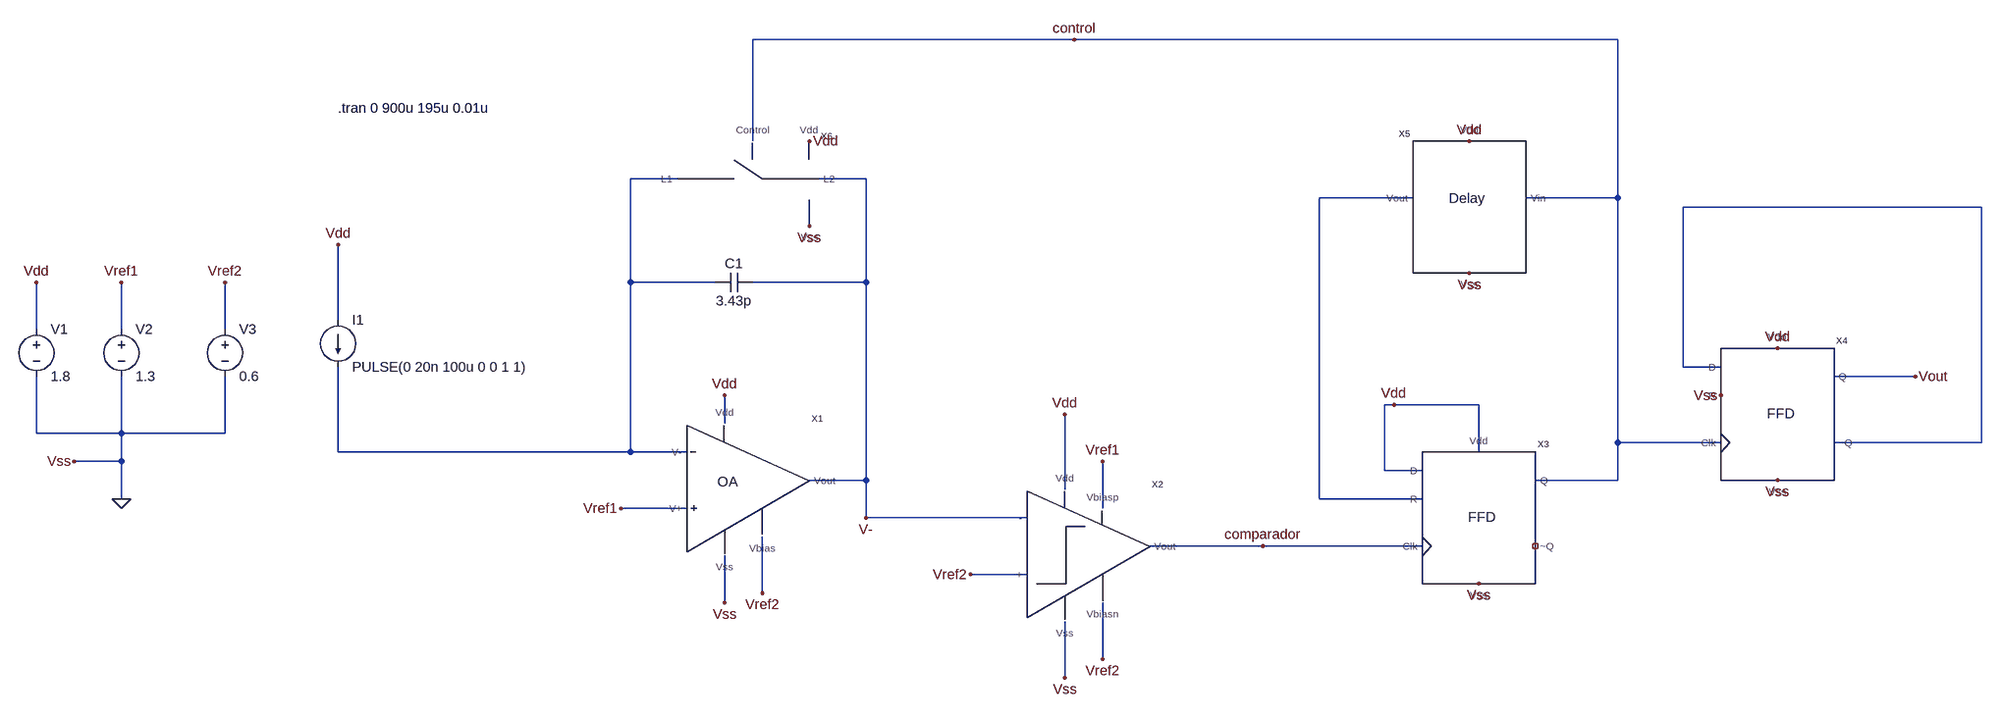
[diagram p0: schematic TOTAL.asc]
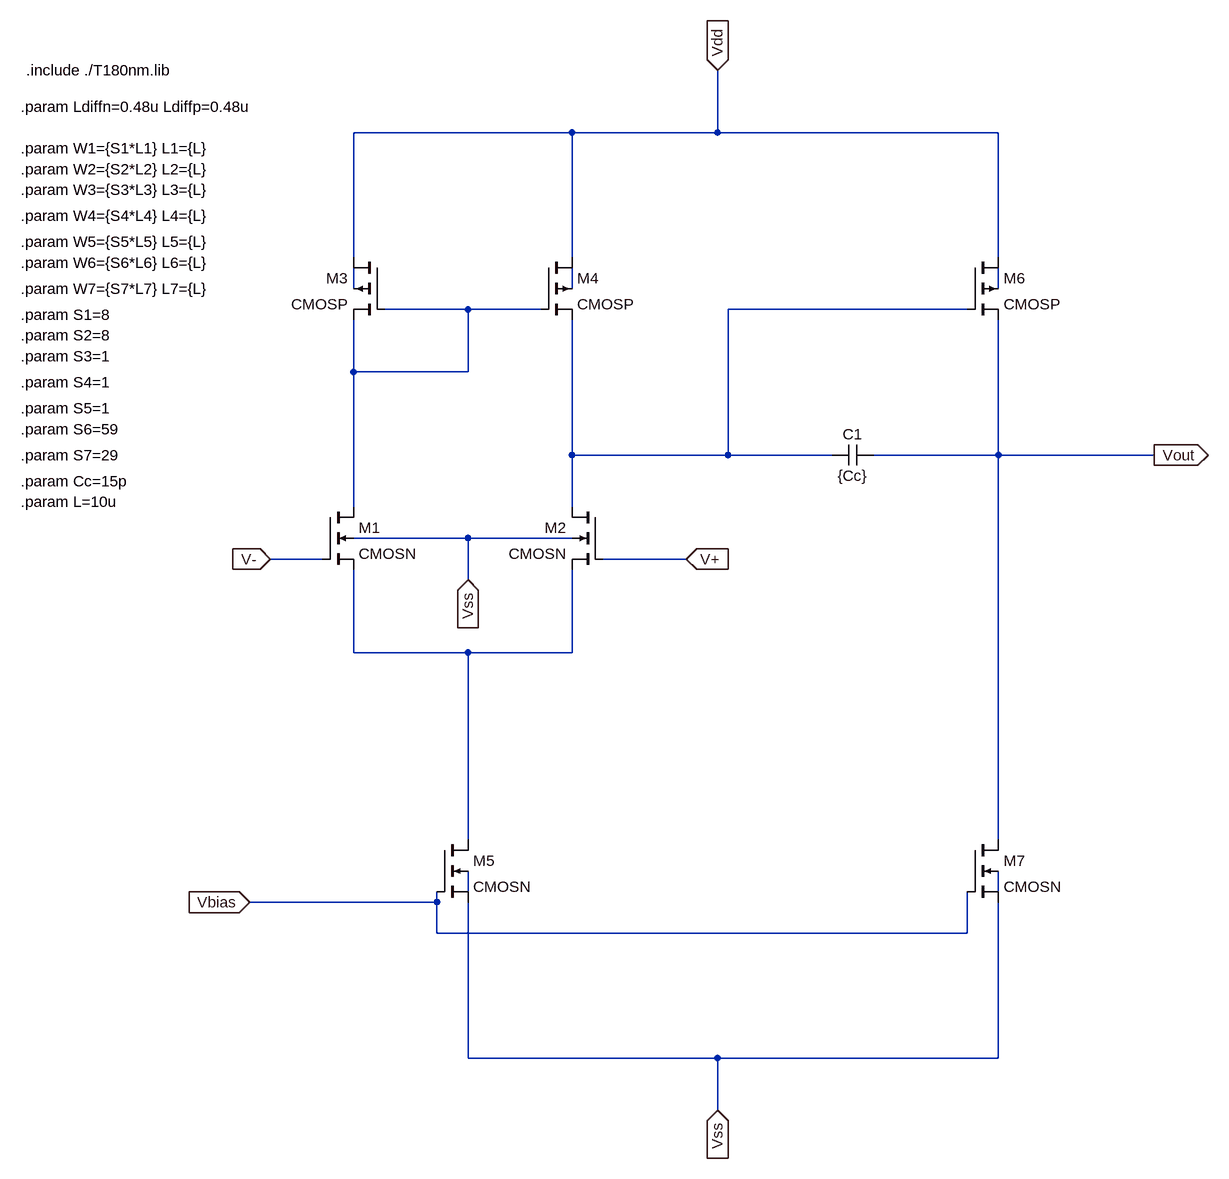
[diagram p1: sub-circuit opamp.asc]
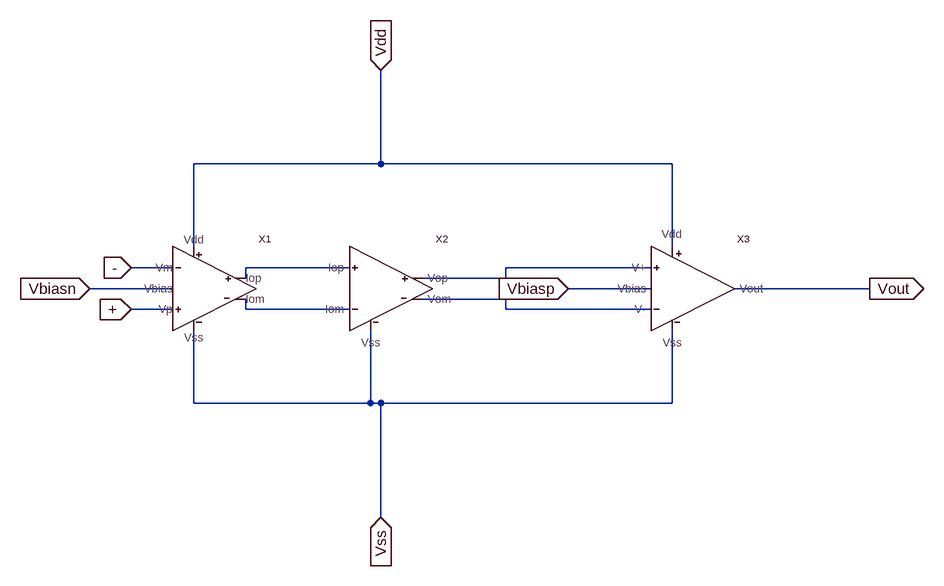
[diagram p2: sub-circuit comparator.asc]
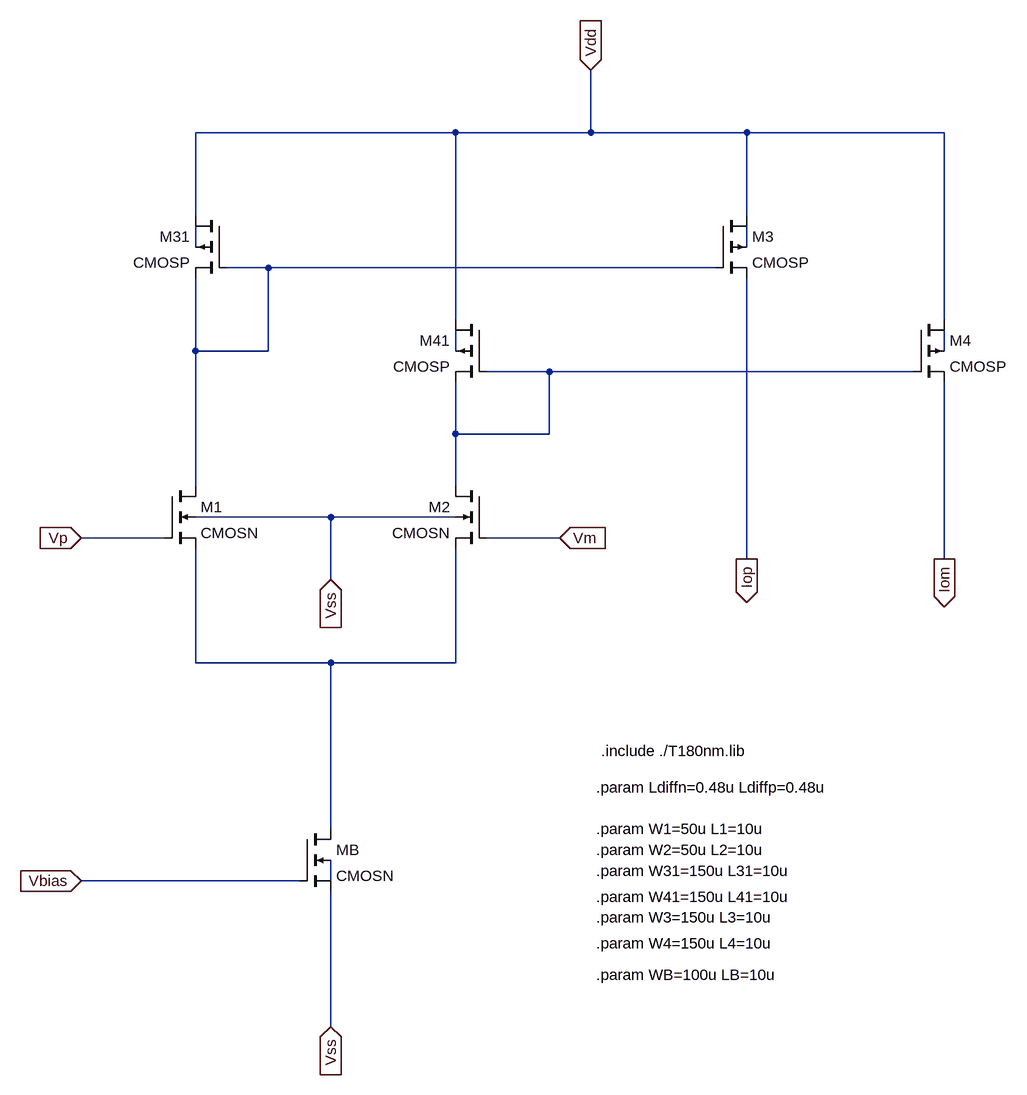
[diagram p3: sub-circuit preamp.asc]
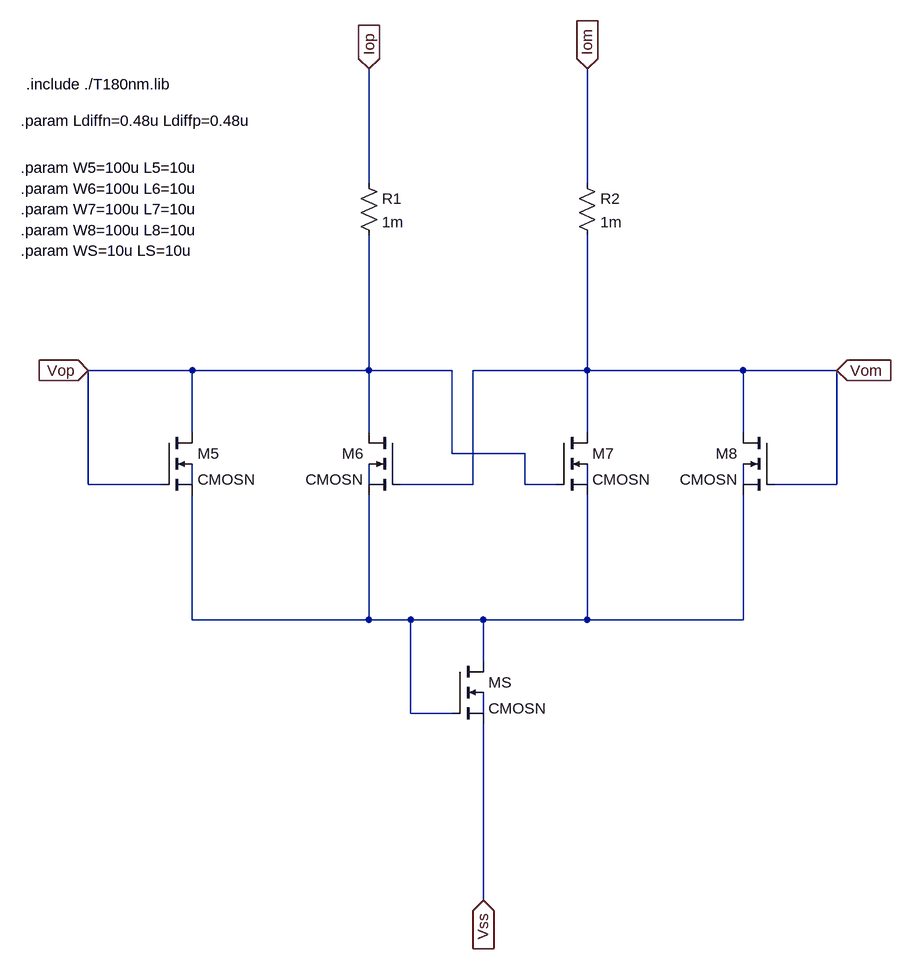
[diagram p4: sub-circuit decision.asc]
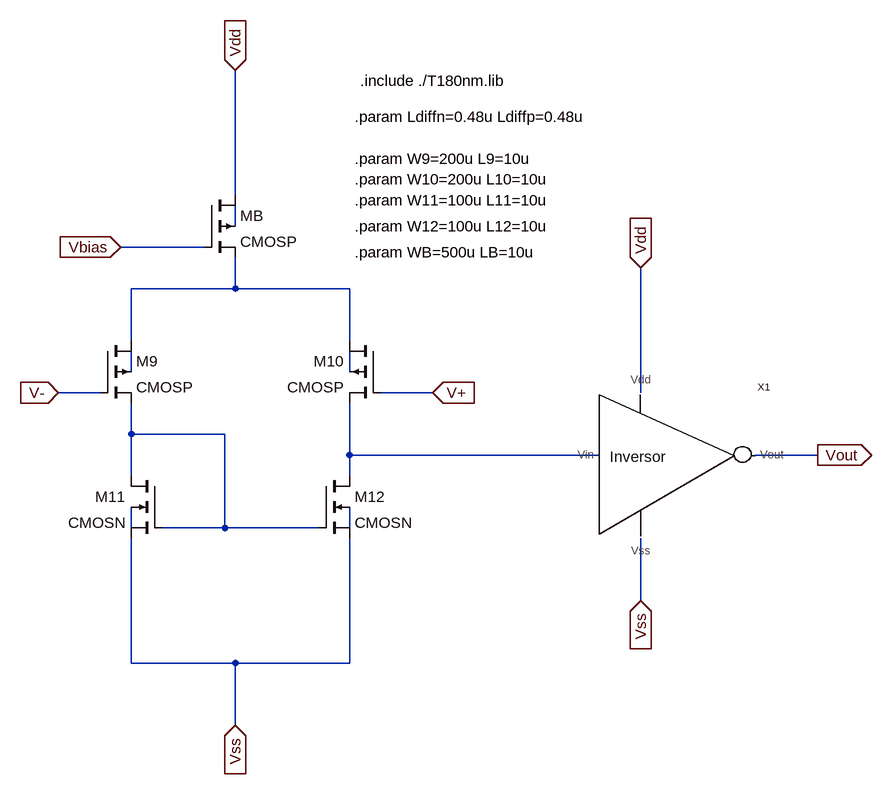
[diagram p5: sub-circuit output_buffer.asc]
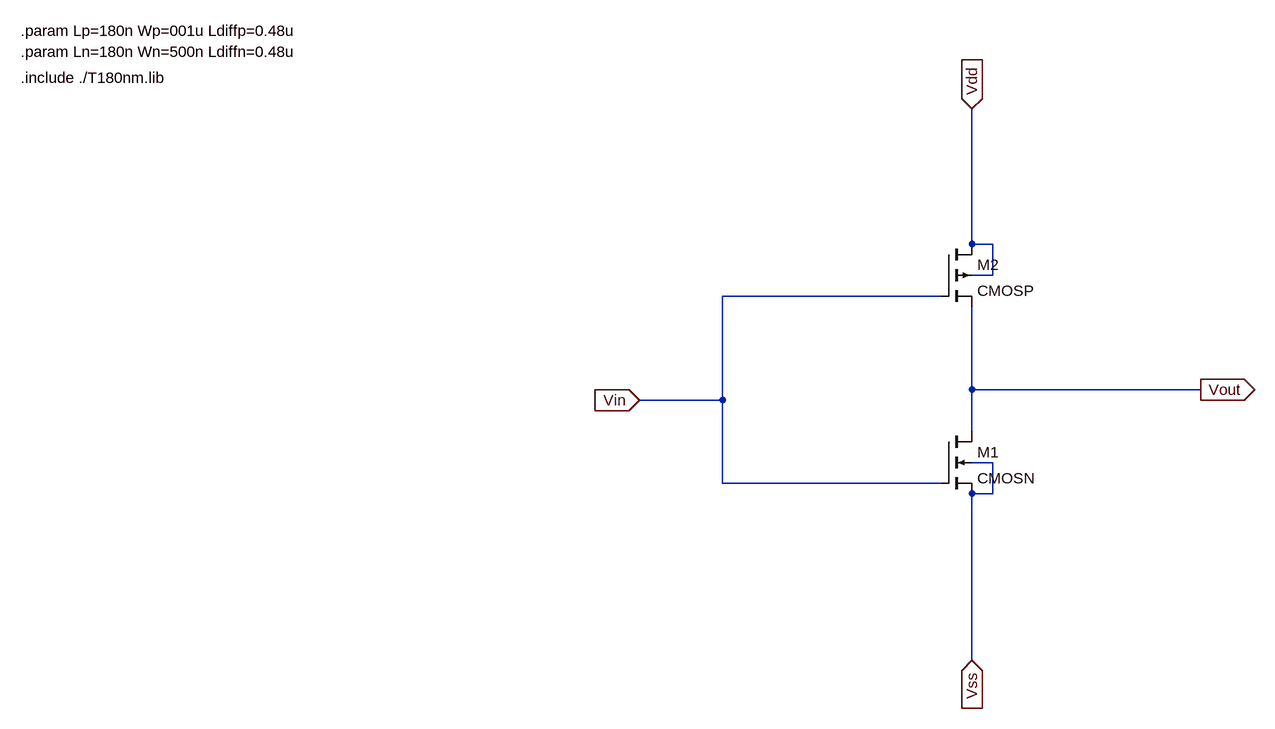
[diagram p6: sub-circuit inversor.asc]
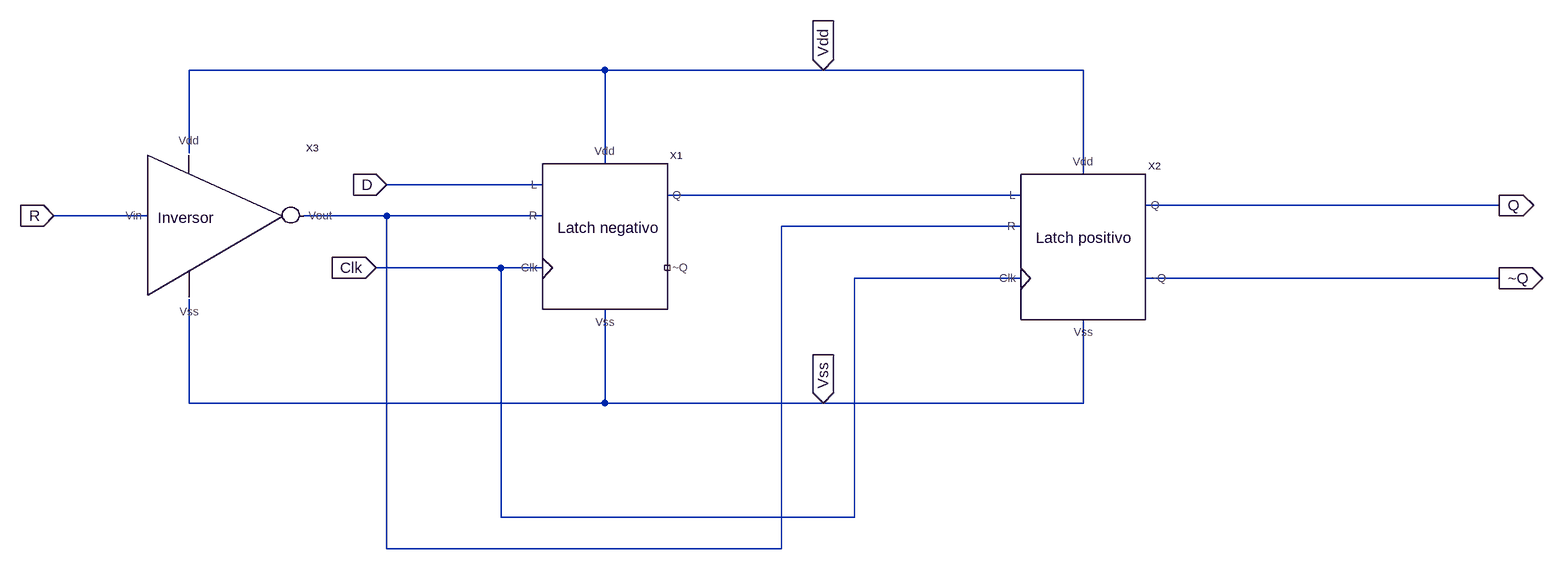
[diagram p7: sub-circuit ffd.asc]
TOTAL.asc, the LTspice schematic file:
Version 4
SHEET 1 2388 1476
WIRE 416 -416 -208 -416
WIRE 1440 -416 416 -416
WIRE -208 -160 -208 -416
WIRE -336 -96 -416 -96
WIRE -16 -96 -96 -96
WIRE 1024 -64 832 -64
WIRE 1440 -64 1440 -416
WIRE 1440 -64 1216 -64
WIRE 2384 -48 1808 -48
WIRE -416 80 -416 -96
WIRE -272 80 -416 80
WIRE -16 80 -16 -96
WIRE -16 80 -208 80
WIRE -912 144 -912 16
WIRE -1584 160 -1584 80
WIRE -1440 160 -1440 80
WIRE -1264 160 -1264 80
WIRE 1808 224 1808 -48
WIRE 1872 224 1808 224
WIRE 2272 240 2064 240
WIRE 992 288 976 288
WIRE 1136 288 992 288
WIRE -256 320 -256 272
WIRE -1584 336 -1584 240
WIRE -1440 336 -1440 240
WIRE -1440 336 -1584 336
WIRE -1264 336 -1264 240
WIRE -1264 336 -1440 336
WIRE 1440 352 1440 -64
WIRE 1872 352 1440 352
WIRE 2384 352 2384 -48
WIRE 2384 352 2064 352
WIRE -912 368 -912 224
WIRE -416 368 -416 80
WIRE -416 368 -912 368
WIRE -320 368 -416 368
WIRE 1136 368 1136 288
WIRE -1440 384 -1440 336
WIRE -1440 384 -1520 384
WIRE 976 400 976 288
WIRE 1040 400 976 400
WIRE -16 416 -16 80
WIRE -16 416 -112 416
WIRE 1440 416 1440 352
WIRE 1440 416 1232 416
WIRE 400 432 400 304
WIRE -1440 448 -1440 384
WIRE 832 448 832 -64
WIRE 1040 448 832 448
WIRE -320 464 -432 464
WIRE 464 464 464 384
WIRE -16 480 -16 416
WIRE 336 480 -16 480
WIRE 736 528 544 528
WIRE 1040 528 736 528
WIRE 336 576 240 576
WIRE -192 608 -192 512
WIRE -256 624 -256 544
WIRE 464 720 464 624
WIRE 400 752 400 656
FLAG -912 16 Vdd
FLAG -256 272 Vdd
FLAG -256 624 Vss
FLAG -432 464 Vref1
FLAG -1584 80 Vdd
FLAG -1440 80 Vref1
FLAG -1520 384 Vss
FLAG -1440 448 0
FLAG 400 304 Vdd
FLAG 400 752 Vss
FLAG 240 576 Vref2
FLAG -1264 80 Vref2
FLAG 2272 240 Vout
FLAG 1968 192 Vdd
FLAG 992 288 Vdd
FLAG 1120 -160 Vdd
FLAG 1136 592 Vss
FLAG 1120 64 Vss
FLAG 1968 416 Vss
FLAG 1872 272 Vss
FLAG -112 -16 Vss
FLAG -112 -160 Vdd
FLAG 464 720 Vref2
FLAG -16 480 V-
FLAG 736 528 comparador
FLAG 416 -416 control
FLAG -192 608 Vref2
FLAG 464 384 Vref1
SYMBOL opamp -256 416 R0
SYMATTR InstName X1
SYMBOL cap -208 64 R90
WINDOW 0 0 32 VBottom 2
WINDOW 3 32 32 VTop 2
SYMATTR InstName C1
SYMATTR Value 3.43p
SYMBOL current -912 144 R0
WINDOW 123 0 0 Left 0
WINDOW 39 0 0 Left 0
SYMATTR InstName I1
SYMATTR Value PULSE(0 20n 100u 0 0 1 1)
SYMBOL voltage -1584 144 R0
WINDOW 123 0 0 Left 0
WINDOW 39 0 0 Left 0
SYMATTR InstName V1
SYMATTR Value 1.8
SYMBOL voltage -1440 144 R0
WINDOW 123 0 0 Left 0
WINDOW 39 0 0 Left 0
SYMATTR InstName V2
SYMATTR Value 1.3
SYMBOL comparator 400 528 R0
SYMATTR InstName X2
SYMBOL voltage -1264 144 R0
WINDOW 123 0 0 Left 0
WINDOW 39 0 0 Left 0
SYMATTR InstName V3
SYMATTR Value 0.6
SYMBOL FFD 1136 480 R0
SYMATTR InstName X3
SYMBOL FFD 1968 304 R0
SYMATTR InstName X4
SYMBOL delay 1152 -64 M0
SYMATTR InstName X5
SYMBOL llave -208 -96 R0
SYMATTR InstName X6
TEXT -912 -216 Left 2 !.tran 0 900u 195u 0.01u

opamp.asc, the sub-circuit schematic file:
Version 4
SHEET 1 1808 1360
WIRE 48 -448 -288 -448
WIRE 272 -448 272 -544
WIRE 272 -448 48 -448
WIRE 704 -448 272 -448
WIRE -288 -256 -288 -448
WIRE 48 -256 48 -448
WIRE 704 -256 704 -448
WIRE -288 -208 -288 -240
WIRE 48 -208 48 -240
WIRE 704 -208 704 -240
WIRE -112 -176 -240 -176
WIRE 0 -176 -112 -176
WIRE 656 -176 288 -176
WIRE -288 -80 -288 -160
WIRE -112 -80 -112 -176
WIRE -112 -80 -288 -80
WIRE 48 48 48 -160
WIRE 288 48 288 -176
WIRE 288 48 48 48
WIRE 448 48 288 48
WIRE 704 48 704 -160
WIRE 704 48 512 48
WIRE 944 48 704 48
WIRE -288 128 -288 -80
WIRE 48 128 48 48
WIRE -112 176 -288 176
WIRE 48 176 -112 176
WIRE -336 208 -416 208
WIRE 224 208 96 208
WIRE -112 240 -112 176
WIRE -288 352 -288 224
WIRE -112 352 -288 352
WIRE 48 352 48 224
WIRE 48 352 -112 352
WIRE -112 640 -112 352
WIRE 704 640 704 48
WIRE -112 720 -112 688
WIRE 704 720 704 688
WIRE -160 736 -160 720
WIRE -160 736 -448 736
WIRE -160 784 -160 736
WIRE 656 784 656 720
WIRE 656 784 -160 784
WIRE -112 976 -112 736
WIRE 272 976 -112 976
WIRE 704 976 704 736
WIRE 704 976 272 976
WIRE 272 1056 272 976
FLAG 272 1056 Vss
IOPIN 272 1056 In
FLAG -448 736 Vbias
IOPIN -448 736 In
FLAG -112 240 Vss
IOPIN -112 240 In
FLAG -416 208 V-
IOPIN -416 208 In
FLAG 224 208 V+
IOPIN 224 208 In
FLAG 272 -544 Vdd
IOPIN 272 -544 In
FLAG 944 48 Vout
IOPIN 944 48 Out
DATAFLAG 48 -32 "Id(x1:M2)"
DATAFLAG -288 -16 "Id(x1:M1)"
DATAFLAG -112 512 "Id(x1:M5)"
DATAFLAG 288 -176 ""
DATAFLAG 496 -448 ""
DATAFLAG 704 288 "Id(x1:M7)"
DATAFLAG 704 -48 "Id(x1:M6)"
DATAFLAG -128 -80 ""
DATAFLAG -96 352 ""
DATAFLAG 800 48 ""
DATAFLAG 256 784 ""
DATAFLAG -384 208 ""
DATAFLAG 160 208 ""
SYMBOL nmos4 -336 128 R0
SYMATTR InstName M1
SYMATTR Value CMOSN
SYMATTR Value2 l={L1} w={W1} ad={Ldiffn*W1} as={Ldiffn*W1} pd={2*Ldiffn+W1} ps={2*Ldiffn+W1}
SYMBOL nmos4 96 128 M0
SYMATTR InstName M2
SYMATTR Value CMOSN
SYMATTR Value2 l={L2} w={W2} ad={Ldiffn*W2} as={Ldiffn*W2} pd={2*Ldiffn+W2} ps={2*Ldiffn+W2}
SYMBOL pmos4 -240 -256 M0
SYMATTR InstName M3
SYMATTR Value CMOSP
SYMATTR Value2 l={L3} w={W3} ad={Ldiffp*W3} as={Ldiffp*W3} pd={2*Ldiffp+W3} ps={2*Ldiffp+W3}
SYMBOL pmos4 0 -256 R0
SYMATTR InstName M4
SYMATTR Value CMOSP
SYMATTR Value2 l={L4} w={W4} ad={Ldiffp*W4} as={Ldiffp*W4} pd={2*Ldiffp+W4} ps={2*Ldiffp+W4}
SYMBOL nmos4 -160 640 R0
SYMATTR InstName M5
SYMATTR Value CMOSN
SYMATTR Value2 l={L5} w={W5} ad={Ldiffn*W5} as={Ldiffn*W5} pd={2*Ldiffn+W5} ps={2*Ldiffn+W5}
SYMBOL pmos4 656 -256 R0
SYMATTR InstName M6
SYMATTR Value CMOSP
SYMATTR Value2 l={L6} w={W6} ad={Ldiffp*W6} as={Ldiffp*W6} pd={2*Ldiffp+W6} ps={2*Ldiffp+W6}
SYMBOL nmos4 656 640 R0
SYMATTR InstName M7
SYMATTR Value CMOSN
SYMATTR Value2 l={L7} w={W7} ad={Ldiffn*W7} as={Ldiffn*W7} pd={2*Ldiffn+W7} ps={2*Ldiffn+W7}
SYMBOL cap 512 32 R90
WINDOW 0 0 32 VBottom 2
WINDOW 3 32 32 VTop 2
SYMATTR InstName C1
SYMATTR Value {Cc}
TEXT -792 -544 Left 2 !.include ./T180nm.lib
TEXT -800 -488 Left 2 !.param Ldiffn=0.48u Ldiffp=0.48u
TEXT -800 -424 Left 2 !.param W1={S1*L1} L1={L}
TEXT -800 -392 Left 2 !.param W2={S2*L2} L2={L}
TEXT -800 -360 Left 2 !.param W3={S3*L3} L3={L}
TEXT -800 -320 Left 2 !.param W4={S4*L4} L4={L}
TEXT -800 -280 Left 2 !.param W5={S5*L5} L5={L}
TEXT -800 88 Left 2 !.param Cc=15p
TEXT -800 120 Left 2 !.param L=10u
TEXT -800 -248 Left 2 !.param W6={S6*L6} L6={L}
TEXT -800 -208 Left 2 !.param W7={S7*L7} L7={L}
TEXT -800 -168 Left 2 !.param S1=8
TEXT -800 -136 Left 2 !.param S2=8
TEXT -800 -104 Left 2 !.param S3=1
TEXT -800 -64 Left 2 !.param S4=1
TEXT -800 -24 Left 2 !.param S5=1
TEXT -800 8 Left 2 !.param S6=59
TEXT -800 48 Left 2 !.param S7=29

comparator.asc, the sub-circuit schematic file:
Version 4
SHEET 1 1328 712
WIRE 464 -96 464 -240
WIRE 464 -96 176 -96
WIRE 912 -96 464 -96
WIRE 176 32 176 -96
WIRE 912 32 912 -96
WIRE 144 64 80 64
WIRE 416 64 256 64
WIRE 880 64 656 64
WIRE 256 80 256 64
WIRE 656 80 656 64
WIRE 656 80 528 80
WIRE 144 96 16 96
WIRE 880 96 752 96
WIRE 1216 96 1008 96
WIRE 656 112 528 112
WIRE 144 128 80 128
WIRE 256 128 256 112
WIRE 416 128 256 128
WIRE 656 128 656 112
WIRE 880 128 656 128
WIRE 176 272 176 160
WIRE 448 272 448 160
WIRE 448 272 176 272
WIRE 464 272 448 272
WIRE 912 272 912 160
WIRE 912 272 464 272
WIRE 464 448 464 272
FLAG 1216 96 Vout
IOPIN 1216 96 Out
FLAG 464 -240 Vdd
IOPIN 464 -240 In
FLAG 464 448 Vss
IOPIN 464 448 In
FLAG 80 64 -
IOPIN 80 64 In
FLAG 80 128 +
IOPIN 80 128 In
FLAG 16 96 Vbiasn
IOPIN 16 96 In
FLAG 752 96 Vbiasp
IOPIN 752 96 In
SYMBOL preamp 176 32 R0
SYMATTR InstName X1
SYMBOL decision 464 96 R0
SYMATTR InstName X2
SYMBOL output_buffer 928 96 R0
SYMATTR InstName X3

preamp.asc, the sub-circuit schematic file:
Version 4
SHEET 1 1088 1248
WIRE 240 -224 -160 -224
WIRE 448 -224 448 -320
WIRE 448 -224 240 -224
WIRE 688 -224 448 -224
WIRE 992 -224 688 -224
WIRE -160 -96 -160 -224
WIRE 688 -96 688 -224
WIRE -160 -48 -160 -80
WIRE 688 -48 688 -80
WIRE -48 -16 -112 -16
WIRE 640 -16 -48 -16
WIRE 240 64 240 -224
WIRE 992 64 992 -224
WIRE -160 112 -160 0
WIRE -48 112 -48 -16
WIRE -48 112 -160 112
WIRE 240 112 240 80
WIRE 992 112 992 80
WIRE 384 144 288 144
WIRE 944 144 384 144
WIRE 240 240 240 160
WIRE 384 240 384 144
WIRE 384 240 240 240
WIRE -160 320 -160 112
WIRE 240 320 240 240
WIRE 48 368 -160 368
WIRE 240 368 48 368
WIRE -208 400 -336 400
WIRE 400 400 288 400
WIRE 688 432 688 0
WIRE 992 432 992 160
WIRE 48 464 48 368
WIRE -160 592 -160 416
WIRE 48 592 -160 592
WIRE 240 592 240 416
WIRE 240 592 48 592
WIRE 48 848 48 592
WIRE 0 928 -336 928
WIRE 48 928 48 896
WIRE 48 1152 48 944
FLAG 448 -320 Vdd
IOPIN 448 -320 In
FLAG 48 464 Vss
IOPIN 48 464 In
FLAG -336 400 Vp
IOPIN -336 400 In
FLAG 400 400 Vm
IOPIN 400 400 In
FLAG 48 1152 Vss
IOPIN 48 1152 In
FLAG -336 928 Vbias
IOPIN -336 928 In
FLAG 688 432 Iop
IOPIN 688 432 Out
FLAG 992 432 Iom
IOPIN 992 432 Out
DATAFLAG 48 736 "Id(x2:x1:Mb)"
DATAFLAG -160 256 ""
DATAFLAG 240 272 ""
DATAFLAG 0 592 ""
DATAFLAG 688 320 "Id(x2:x1:M3)"
DATAFLAG 992 320 "Id(x2:x1:M4)"
SYMBOL nmos4 -208 320 R0
SYMATTR InstName M1
SYMATTR Value CMOSN
SYMATTR Value2 l={L1} w={W1} ad={Ldiffn*W1} as={Ldiffn*W1} pd={2*Ldiffn+W1} ps={2*Ldiffn+W1}
SYMBOL pmos4 288 64 M0
SYMATTR InstName M41
SYMATTR Value CMOSP
SYMATTR Value2 l={L41} w={W41} ad={Ldiffp*W41} as={Ldiffp*W41} pd={2*Ldiffp+W41} ps={2*Ldiffp+W41}
SYMBOL nmos4 288 320 M0
SYMATTR InstName M2
SYMATTR Value CMOSN
SYMATTR Value2 l={L2} w={W2} ad={Ldiffn*W2} as={Ldiffn*W2} pd={2*Ldiffn+W2} ps={2*Ldiffn+W2}
SYMBOL pmos4 -112 -96 M0
SYMATTR InstName M31
SYMATTR Value CMOSP
SYMATTR Value2 l={L31} w={W31} ad={Ldiffp*W31} as={Ldiffp*W31} pd={2*Ldiffp+W31} ps={2*Ldiffp+W31}
SYMBOL pmos4 640 -96 R0
SYMATTR InstName M3
SYMATTR Value CMOSP
SYMATTR Value2 l={L3} w={W3} ad={Ldiffp*W3} as={Ldiffp*W3} pd={2*Ldiffp+W3} ps={2*Ldiffp+W3}
SYMBOL pmos4 944 64 R0
SYMATTR InstName M4
SYMATTR Value CMOSP
SYMATTR Value2 l={L4} w={W4} ad={Ldiffp*W4} as={Ldiffp*W4} pd={2*Ldiffp+W4} ps={2*Ldiffp+W4}
SYMBOL nmos4 0 848 R0
SYMATTR InstName MB
SYMATTR Value CMOSN
SYMATTR Value2 l={LB} w={WB} ad={Ldiffn*WB} as={Ldiffn*WB} pd={2*Ldiffn+WB} ps={2*Ldiffn+WB}
TEXT 464 728 Left 2 !.include ./T180nm.lib
TEXT 456 784 Left 2 !.param Ldiffn=0.48u Ldiffp=0.48u
TEXT 456 848 Left 2 !.param W1=50u L1=10u
TEXT 456 880 Left 2 !.param W2=50u L2=10u
TEXT 456 912 Left 2 !.param W31=150u L31=10u
TEXT 456 952 Left 2 !.param W41=150u L41=10u
TEXT 456 984 Left 2 !.param W3=150u L3=10u
TEXT 456 1024 Left 2 !.param W4=150u L4=10u
TEXT 456 1072 Left 2 !.param WB=100u LB=10u

decision.asc, the sub-circuit schematic file:
Version 4
SHEET 1 1240 1248
WIRE 144 -208 144 -384
WIRE 480 -208 480 -384
WIRE -128 80 -288 80
WIRE 144 80 144 -128
WIRE 144 80 -128 80
WIRE 272 80 144 80
WIRE 480 80 480 -128
WIRE 480 80 304 80
WIRE 720 80 480 80
WIRE 864 80 720 80
WIRE -128 176 -128 80
WIRE 144 176 144 80
WIRE 480 176 480 80
WIRE 720 176 720 80
WIRE 272 208 272 80
WIRE 384 208 272 208
WIRE -288 256 -288 80
WIRE -176 256 -288 256
WIRE -128 256 -128 224
WIRE 144 256 144 224
WIRE 304 256 304 80
WIRE 304 256 192 256
WIRE 384 256 384 208
WIRE 432 256 384 256
WIRE 480 256 480 224
WIRE 720 256 720 224
WIRE 864 256 864 80
WIRE 864 256 768 256
WIRE -128 464 -128 272
WIRE 144 464 144 272
WIRE 144 464 -128 464
WIRE 208 464 144 464
WIRE 320 464 208 464
WIRE 480 464 480 272
WIRE 480 464 320 464
WIRE 720 464 720 272
WIRE 720 464 480 464
WIRE 320 528 320 464
WIRE 208 608 208 464
WIRE 272 608 208 608
WIRE 320 608 320 576
WIRE 320 896 320 624
FLAG 144 -384 Iop
IOPIN 144 -384 In
FLAG 480 -384 Iom
IOPIN 480 -384 In
FLAG 320 896 Vss
IOPIN 320 896 In
FLAG -288 80 Vop
IOPIN -288 80 In
FLAG 864 80 Vom
IOPIN 864 80 In
SYMBOL nmos4 192 176 M0
SYMATTR InstName M6
SYMATTR Value CMOSN
SYMATTR Value2 l={L6} w={W6} ad={Ldiffn*W6} as={Ldiffn*W6} pd={2*Ldiffn+W6} ps={2*Ldiffn+W6}
SYMBOL nmos4 768 176 M0
SYMATTR InstName M8
SYMATTR Value CMOSN
SYMATTR Value2 l={L8} w={W8} ad={Ldiffn*W8} as={Ldiffn*W8} pd={2*Ldiffn+W8} ps={2*Ldiffn+W8}
SYMBOL nmos4 432 176 R0
SYMATTR InstName M7
SYMATTR Value CMOSN
SYMATTR Value2 l={L7} w={W7} ad={Ldiffn*W7} as={Ldiffn*W7} pd={2*Ldiffn+W7} ps={2*Ldiffn+W7}
SYMBOL nmos4 -176 176 R0
SYMATTR InstName M5
SYMATTR Value CMOSN
SYMATTR Value2 l={L5} w={W5} ad={Ldiffn*W5} as={Ldiffn*W5} pd={2*Ldiffn+W5} ps={2*Ldiffn+W5}
SYMBOL res 128 -224 R0
SYMATTR InstName R1
SYMATTR Value 1m
SYMBOL res 464 -224 R0
SYMATTR InstName R2
SYMATTR Value 1m
SYMBOL nmos4 272 528 R0
SYMATTR InstName MS
SYMATTR Value CMOSN
SYMATTR Value2 l={LS} w={WS} ad={Ldiffn*WS} as={Ldiffn*WS} pd={2*Ldiffn+WS} ps={2*Ldiffn+WS}
TEXT -384 -360 Left 2 !.include ./T180nm.lib
TEXT -392 -304 Left 2 !.param Ldiffn=0.48u Ldiffp=0.48u
TEXT -392 -232 Left 2 !.param W5=100u L5=10u
TEXT -392 -200 Left 2 !.param W6=100u L6=10u
TEXT -392 -168 Left 2 !.param W7=100u L7=10u
TEXT -392 -136 Left 2 !.param W8=100u L8=10u
TEXT -392 -104 Left 2 !.param WS=10u LS=10u

output_buffer.asc, the sub-circuit schematic file:
Version 4
SHEET 1 1808 1360
WIRE -128 -304 -128 -496
WIRE -128 -256 -128 -288
WIRE -176 -224 -304 -224
WIRE -128 -160 -128 -208
WIRE -128 -160 -288 -160
WIRE 48 -160 -128 -160
WIRE -288 -80 -288 -160
WIRE 48 -80 48 -160
WIRE -288 -32 -288 -64
WIRE 48 -32 48 -64
WIRE -336 0 -400 0
WIRE 176 0 96 0
WIRE 496 0 496 -192
WIRE -288 64 -288 16
WIRE -144 64 -288 64
WIRE 48 96 48 16
WIRE 432 96 48 96
WIRE 768 96 672 96
WIRE -288 128 -288 64
WIRE 48 128 48 96
WIRE -288 208 -288 176
WIRE -144 208 -144 64
WIRE -144 208 -240 208
WIRE 0 208 -144 208
WIRE 48 208 48 176
WIRE 496 320 496 224
WIRE -288 416 -288 224
WIRE -128 416 -288 416
WIRE 48 416 48 224
WIRE 48 416 -128 416
WIRE -128 512 -128 416
FLAG -128 -496 Vdd
IOPIN -128 -496 In
FLAG -304 -224 Vbias
IOPIN -304 -224 In
FLAG -128 512 Vss
IOPIN -128 512 In
FLAG 496 -192 Vdd
IOPIN 496 -192 In
FLAG 496 320 Vss
IOPIN 496 320 In
FLAG 768 96 Vout
IOPIN 768 96 Out
FLAG -400 0 V-
IOPIN -400 0 In
FLAG 176 0 V+
IOPIN 176 0 In
SYMBOL nmos4 -240 128 M0
SYMATTR InstName M11
SYMATTR Value CMOSN
SYMATTR Value2 l={L11} w={W11} ad={Ldiffn*W11} as={Ldiffn*W11} pd={2*Ldiffn+W11} ps={2*Ldiffn+W11}
SYMBOL nmos4 0 128 R0
SYMATTR InstName M12
SYMATTR Value CMOSN
SYMATTR Value2 l={L12} w={W12} ad={Ldiffn*W12} as={Ldiffn*W12} pd={2*Ldiffn+W12} ps={2*Ldiffn+W12}
SYMBOL pmos4 -336 -80 R0
SYMATTR InstName M9
SYMATTR Value CMOSP
SYMATTR Value2 l={L9} w={W9} ad={Ldiffp*W9} as={Ldiffp*W9} pd={2*Ldiffp+W9} ps={2*Ldiffp+W9}
SYMBOL pmos4 -176 -304 R0
SYMATTR InstName MB
SYMATTR Value CMOSP
SYMATTR Value2 l={LB} w={WB} ad={Ldiffp*WB} as={Ldiffp*WB} pd={2*Ldiffp+WB} ps={2*Ldiffp+WB}
SYMBOL pmos4 96 -80 M0
SYMATTR InstName M10
SYMATTR Value CMOSP
SYMATTR Value2 l={L10} w={W10} ad={Ldiffp*W10} as={Ldiffp*W10} pd={2*Ldiffp+W10} ps={2*Ldiffp+W10}
SYMBOL inversor 496 96 R0
SYMATTR InstName X1
TEXT 64 -480 Left 2 !.include ./T180nm.lib
TEXT 56 -424 Left 2 !.param Ldiffn=0.48u Ldiffp=0.48u
TEXT 56 -360 Left 2 !.param W9=200u L9=10u
TEXT 56 -328 Left 2 !.param W10=200u L10=10u
TEXT 56 -296 Left 2 !.param W11=100u L11=10u
TEXT 56 -256 Left 2 !.param W12=100u L12=10u
TEXT 56 -216 Left 2 !.param WB=500u LB=10u

inversor.asc, the sub-circuit schematic file:
Version 4
SHEET 1 880 712
WIRE 224 -96 224 -304
WIRE 256 -96 224 -96
WIRE 256 -48 256 -96
WIRE 256 -48 224 -48
WIRE 176 -16 -160 -16
WIRE 224 128 224 0
WIRE 576 128 224 128
WIRE -160 144 -160 -16
WIRE -160 144 -288 144
WIRE 224 192 224 128
WIRE 256 240 224 240
WIRE -160 272 -160 144
WIRE 176 272 -160 272
WIRE 256 288 256 240
WIRE 256 288 224 288
WIRE 224 544 224 288
FLAG -288 144 Vin
IOPIN -288 144 In
FLAG 576 128 Vout
IOPIN 576 128 Out
FLAG 224 -304 Vdd
IOPIN 224 -304 In
FLAG 224 544 Vss
IOPIN 224 544 In
SYMBOL nmos4 176 192 R0
SYMATTR InstName M1
SYMATTR Value CMOSN
SYMATTR Value2 l={Ln} w={Wn} ad={Ldiffn*Wn} as={Ldiffn*Wn} pd={2*Ldiffn+Wn} ps={2*Ldiffn+Wn}
SYMBOL pmos4 176 -96 R0
SYMATTR InstName M2
SYMATTR Value CMOSP
SYMATTR Value2 l={Lp} w={Wp} ad={Ldiffp*Wp} as={Ldiffp*Wp} pd={2*Ldiffp+Wp} ps={2*Ldiffp+Wp}
TEXT -1240 -352 Left 2 !.include ./T180nm.lib
TEXT -1240 -424 Left 2 !.param Lp=180n Wp=001u Ldiffp=0.48u
TEXT -1240 -392 Left 2 !.param Ln=180n Wn=500n Ldiffn=0.48u

ffd.asc, the sub-circuit schematic file:
Version 4
SHEET 1 1432 1476
WIRE -288 -160 -928 -160
WIRE 48 -160 -288 -160
WIRE 448 -160 48 -160
WIRE -928 -32 -928 -160
WIRE -288 -16 -288 -160
WIRE 448 0 448 -160
WIRE -384 16 -624 16
WIRE 352 32 -192 32
WIRE 1088 48 544 48
WIRE -992 64 -1136 64
WIRE -624 64 -752 64
WIRE -384 64 -624 64
WIRE 352 80 -16 80
WIRE -448 144 -640 144
WIRE -384 144 -448 144
WIRE 352 160 96 160
WIRE 1088 160 544 160
WIRE -928 352 -928 192
WIRE -288 352 -288 208
WIRE -288 352 -928 352
WIRE 48 352 -288 352
WIRE 448 352 448 224
WIRE 448 352 48 352
WIRE -448 528 -448 144
WIRE 96 528 96 160
WIRE 96 528 -448 528
WIRE -624 576 -624 64
WIRE -16 576 -16 80
WIRE -16 576 -624 576
FLAG -624 16 D
IOPIN -624 16 In
FLAG -640 144 Clk
IOPIN -640 144 In
FLAG 48 -160 Vdd
IOPIN 48 -160 In
FLAG 48 352 Vss
IOPIN 48 352 In
FLAG 1088 160 ~Q
IOPIN 1088 160 Out
FLAG 1088 48 Q
IOPIN 1088 48 Out
FLAG -1136 64 R
IOPIN -1136 64 In
SYMBOL latch_negativo -288 96 R0
SYMATTR InstName X1
SYMBOL latch_positivo 448 112 R0
SYMATTR InstName X2
SYMBOL inversor -928 64 R0
SYMATTR InstName X3

latch_negativo.asc, the sub-circuit schematic file:
Version 4
SHEET 1 1432 1476
WIRE -256 -336 -976 -336
WIRE 288 -64 -160 -64
WIRE 880 -64 288 -64
WIRE -256 0 -256 -336
WIRE -336 32 -784 32
WIRE -160 32 -160 -64
WIRE 288 48 288 -64
WIRE 880 48 880 -64
WIRE 224 96 -144 96
WIRE -336 144 -432 144
WIRE 640 144 464 144
WIRE 816 144 640 144
WIRE 1248 144 1056 144
WIRE 224 208 128 208
WIRE -160 352 -160 160
WIRE 288 352 288 272
WIRE 288 352 -160 352
WIRE 880 352 880 272
WIRE 880 352 288 352
WIRE -784 416 -784 32
WIRE 1248 416 1248 144
WIRE 1248 416 -784 416
WIRE -448 560 -448 512
WIRE -976 656 -976 -336
WIRE -976 656 -1008 656
WIRE -512 656 -976 656
WIRE -256 656 -256 192
WIRE -256 656 -272 656
WIRE -448 832 -448 784
FLAG -432 144 L
IOPIN -432 144 In
FLAG 128 208 R
IOPIN 128 208 In
FLAG -1008 656 Clk
IOPIN -1008 656 In
FLAG 288 352 Vss
IOPIN 288 352 In
FLAG -448 512 Vdd
IOPIN -448 512 In
FLAG -448 832 Vss
IOPIN -448 832 In
FLAG 288 -64 Vdd
IOPIN 288 -64 In
FLAG 1248 144 Q
IOPIN 1248 144 Out
FLAG 640 144 ~Q
IOPIN 640 144 Out
SYMBOL mux -272 80 R0
SYMATTR InstName X1
SYMBOL nand 288 144 R0
SYMATTR InstName X2
SYMBOL inversor 880 144 R0
SYMATTR InstName X3
SYMBOL inversor -448 656 R0
SYMATTR InstName X4

mux.asc, the sub-circuit schematic file:
Version 4
SHEET 1 1664 1760
WIRE 944 -1056 -608 -1056
WIRE 608 -784 -320 -784
WIRE 624 -784 608 -784
WIRE -320 -752 -320 -784
WIRE -320 -736 -320 -752
WIRE -608 -704 -608 -1056
WIRE -1712 -624 -1712 -784
WIRE -1696 -624 -1712 -624
WIRE 384 -560 -320 -560
WIRE -1760 -528 -1904 -528
WIRE -1520 -528 -1536 -528
WIRE -880 -528 -1520 -528
WIRE 1216 -512 1168 -512
WIRE -608 -368 -608 -384
WIRE -288 -368 -288 -384
WIRE 1216 -336 1216 -512
WIRE -1696 -288 -1696 -400
WIRE -1696 -288 -1728 -288
WIRE 384 -272 384 -560
WIRE 1040 -272 384 -272
WIRE 1040 -240 1040 -272
WIRE 1152 -240 1040 -240
WIRE 1552 -240 1392 -240
WIRE -608 -64 -608 -368
WIRE -608 -64 -1072 -64
WIRE -288 -48 -288 -368
WIRE 128 -48 -288 -48
WIRE 1216 16 1216 -112
WIRE 1216 16 1184 16
WIRE 624 224 624 -784
WIRE 624 224 -320 224
WIRE -608 272 -608 -64
WIRE -1920 352 -1920 208
WIRE -320 416 -336 416
WIRE 384 416 384 -272
WIRE 384 416 -320 416
WIRE -1984 448 -2112 448
WIRE -880 448 -1744 448
WIRE -288 608 -288 592
WIRE -288 704 -288 608
WIRE 128 704 128 -48
WIRE 128 704 -288 704
WIRE -1952 752 -1952 736
WIRE -1920 752 -1920 576
WIRE -1920 752 -1952 752
WIRE -608 1344 -608 608
WIRE 944 1344 944 -1056
WIRE 944 1344 -608 1344
WIRE -608 1632 -608 1344
FLAG -1072 -64 ~Control
IOPIN -1072 -64 In
FLAG -288 -48 Vss
IOPIN -288 -48 In
FLAG 608 -784 Vdd
IOPIN 608 -784 In
FLAG -608 1632 Control
FLAG -1904 -528 V1
IOPIN -1904 -528 In
FLAG -2112 448 V0
IOPIN -2112 448 In
FLAG -1712 -784 Vdd
IOPIN -1712 -784 In
FLAG -1728 -288 Vss
IOPIN -1728 -288 In
FLAG -1920 208 Vdd
IOPIN -1920 208 In
FLAG -1952 736 Vss
IOPIN -1952 736 In
FLAG 1168 -512 Vdd
IOPIN 1168 -512 In
FLAG 1184 16 Vss
IOPIN 1184 16 In
FLAG 1552 -240 Vout
IOPIN 1552 -240 Out
SYMBOL transgate -624 -544 R0
SYMATTR InstName X1
SYMBOL transgate -624 432 R0
SYMATTR InstName X2
SYMBOL inversor -1696 -528 R0
SYMATTR InstName X3
SYMBOL inversor -1920 448 R0
SYMATTR InstName X4
SYMBOL inversor 1216 -240 R0
SYMATTR InstName X5

transgate.asc, the sub-circuit schematic file:
Version 4
SHEET 1 880 712
WIRE 192 -128 192 -272
WIRE 176 -80 -160 -80
WIRE 432 -80 272 -80
WIRE 224 80 224 -80
WIRE 224 80 192 80
WIRE -160 144 -160 -80
WIRE -160 144 -288 144
WIRE 432 144 432 -80
WIRE 560 144 432 144
WIRE 240 176 192 176
WIRE -160 304 -160 144
WIRE 192 304 -160 304
WIRE 240 304 240 176
WIRE 432 304 432 144
WIRE 432 304 288 304
WIRE 272 528 272 352
FLAG -288 144 Vin
IOPIN -288 144 In
FLAG 560 144 Vout
IOPIN 560 144 Out
FLAG 192 -272 Control
IOPIN 192 -272 In
FLAG 272 528 ~Control
IOPIN 272 528 In
FLAG 192 176 Vdd
IOPIN 192 176 In
FLAG 192 80 Vss
IOPIN 192 80 In
SYMBOL nmos4 272 -128 R90
SYMATTR InstName M1
SYMATTR Value CMOSN
SYMATTR Value2 l={Ln} w={Wn} ad={Ldiffn*Wn} as={Ldiffn*Wn} pd={2*Ldiffn+Wn} ps={2*Ldiffn+Wn}
SYMBOL pmos4 192 352 R270
SYMATTR InstName M2
SYMATTR Value CMOSP
SYMATTR Value2 l={Lp} w={Wp} ad={Ldiffp*Wp} as={Ldiffp*Wp} pd={2*Ldiffp+Wp} ps={2*Ldiffp+Wp}
TEXT -1240 -352 Left 2 !.include ./T180nm.lib
TEXT -1240 -424 Left 2 !.param Lp=180n Wp=001u Ldiffp=0.48u
TEXT -1240 -392 Left 2 !.param Ln=180n Wn=500n Ldiffn=0.48u

nand.asc, the sub-circuit schematic file:
Version 4
SHEET 1 880 712
WIRE 208 -240 208 -320
WIRE 208 -240 112 -240
WIRE 304 -240 208 -240
WIRE 112 -96 112 -240
WIRE 144 -96 112 -96
WIRE 304 -96 304 -240
WIRE 336 -96 304 -96
WIRE 304 -80 304 -96
WIRE 144 -48 144 -96
WIRE 144 -48 112 -48
WIRE 336 -48 336 -96
WIRE 336 -48 304 -48
WIRE 64 -16 16 -16
WIRE 256 -16 240 -16
WIRE 112 48 112 0
WIRE 224 48 112 48
WIRE 304 48 304 0
WIRE 304 48 224 48
WIRE 224 128 224 48
WIRE 576 128 224 128
WIRE 224 192 224 128
WIRE 320 240 224 240
WIRE 176 272 128 272
WIRE 224 368 224 288
WIRE 256 416 224 416
WIRE 320 416 320 240
WIRE 320 416 256 416
WIRE 176 448 128 448
WIRE 256 448 256 416
WIRE 256 448 224 448
WIRE 224 544 224 464
FLAG 576 128 Vout
IOPIN 576 128 Out
FLAG 208 -320 Vdd
IOPIN 208 -320 In
FLAG 224 544 Vss
IOPIN 224 544 In
FLAG 16 -16 A
IOPIN 16 -16 In
FLAG 128 272 A
IOPIN 128 272 In
FLAG 128 448 B
IOPIN 128 448 In
FLAG 240 -16 B
IOPIN 240 -16 In
SYMBOL nmos4 176 192 R0
SYMATTR InstName M1
SYMATTR Value CMOSN
SYMATTR Value2 l={Ln} w={Wn} ad={Ldiffn*Wn} as={Ldiffn*Wn} pd={2*Ldiffn+Wn} ps={2*Ldiffn+Wn}
SYMBOL pmos4 64 -96 R0
SYMATTR InstName M2
SYMATTR Value CMOSP
SYMATTR Value2 l={Lp} w={Wp} ad={Ldiffp*Wp} as={Ldiffp*Wp} pd={2*Ldiffp+Wp} ps={2*Ldiffp+Wp}
SYMBOL pmos4 256 -96 R0
SYMATTR InstName M3
SYMATTR Value CMOSP
SYMATTR Value2 l={Lp} w={Wp} ad={Ldiffp*Wp} as={Ldiffp*Wp} pd={2*Ldiffp+Wp} ps={2*Ldiffp+Wp}
SYMBOL nmos4 176 368 R0
SYMATTR InstName M4
SYMATTR Value CMOSN
SYMATTR Value2 l={Ln} w={Wn} ad={Ldiffn*Wn} as={Ldiffn*Wn} pd={2*Ldiffn+Wn} ps={2*Ldiffn+Wn}
TEXT -1240 -352 Left 2 !.include ./T180nm.lib
TEXT -1240 -424 Left 2 !.param Lp=180n Wp=001u Ldiffp=0.48u
TEXT -1240 -392 Left 2 !.param Ln=180n Wn=500n Ldiffn=0.48u

latch_positivo.asc, the sub-circuit schematic file:
Version 4
SHEET 1 1432 1476
WIRE -256 -336 -976 -336
WIRE 288 -64 -160 -64
WIRE 880 -64 288 -64
WIRE -256 0 -256 -336
WIRE -336 32 -848 32
WIRE -160 32 -160 -64
WIRE 288 48 288 -64
WIRE 880 48 880 -64
WIRE 224 96 -144 96
WIRE -336 144 -784 144
WIRE 640 144 464 144
WIRE 816 144 640 144
WIRE 1248 144 1056 144
WIRE 224 208 128 208
WIRE -160 352 -160 160
WIRE 288 352 288 272
WIRE 288 352 -160 352
WIRE 880 352 880 272
WIRE 880 352 288 352
WIRE -784 416 -784 144
WIRE 1248 416 1248 144
WIRE 1248 416 -784 416
WIRE -448 560 -448 512
WIRE -976 656 -976 -336
WIRE -976 656 -1008 656
WIRE -512 656 -976 656
WIRE -256 656 -256 192
WIRE -256 656 -272 656
WIRE -448 832 -448 784
FLAG -848 32 L
IOPIN -848 32 In
FLAG 128 208 R
IOPIN 128 208 In
FLAG -1008 656 Clk
IOPIN -1008 656 In
FLAG 288 352 Vss
IOPIN 288 352 In
FLAG -448 512 Vdd
IOPIN -448 512 In
FLAG -448 832 Vss
IOPIN -448 832 In
FLAG 288 -64 Vdd
IOPIN 288 -64 In
FLAG 1248 144 Q
IOPIN 1248 144 Out
FLAG 640 144 ~Q
IOPIN 640 144 Out
SYMBOL mux -272 80 R0
SYMATTR InstName X1
SYMBOL nand 288 144 R0
SYMATTR InstName X2
SYMBOL inversor 880 144 R0
SYMATTR InstName X3
SYMBOL inversor -448 656 R0
SYMATTR InstName X4

delay.asc, the sub-circuit schematic file:
Version 4
SHEET 1 2560 1476
WIRE 720 -208 224 -208
WIRE 1200 -208 1200 -368
WIRE 1200 -208 720 -208
WIRE 1632 -208 1200 -208
WIRE 2064 -208 1632 -208
WIRE 224 32 224 -208
WIRE 720 32 720 -208
WIRE 1632 32 1632 -208
WIRE 2064 32 2064 -208
WIRE 160 128 -176 128
WIRE 656 128 400 128
WIRE 1200 128 896 128
WIRE 1568 128 1200 128
WIRE 2000 128 1808 128
WIRE 2448 128 2240 128
WIRE 1200 304 1200 128
WIRE 224 720 224 256
WIRE 720 720 720 256
WIRE 720 720 224 720
WIRE 1200 720 1200 368
WIRE 1200 720 720 720
WIRE 1632 720 1632 256
WIRE 1632 720 1200 720
WIRE 2064 720 2064 256
WIRE 2064 720 1632 720
WIRE 1200 832 1200 720
FLAG -176 128 Vin
IOPIN -176 128 In
FLAG 1200 -368 Vdd
IOPIN 1200 -368 In
FLAG 1200 832 Vss
IOPIN 1200 832 In
FLAG 2448 128 Vout
IOPIN 2448 128 Out
SYMBOL inversor 224 128 R0
SYMATTR InstName X1
SYMBOL inversor 720 128 R0
WINDOW 39 -48 31 Left 2
SYMATTR SpiceLine Lp={L} Ln={L} Wp={W} Wn={W/2}
SYMATTR InstName X2
SYMBOL inversor 1632 128 R0
WINDOW 39 -48 31 Left 2
SYMATTR SpiceLine Lp={L} Ln={L} Wp={W} Wn={W/2}
SYMATTR InstName X3
SYMBOL cap 1184 304 R0
SYMATTR InstName C1
SYMATTR Value {C}
SYMBOL inversor 2064 128 R0
SYMATTR InstName X4
TEXT -136 -160 Left 2 !.param L=3u W=1u C=1.55p

llave.asc, the sub-circuit schematic file:
Version 4
SHEET 1 880 1248
WIRE 48 208 48 128
WIRE 448 352 336 352
WIRE -224 384 -320 384
WIRE 48 688 48 544
WIRE -48 864 -128 864
WIRE 272 864 176 864
WIRE 48 1104 48 928
FLAG -320 384 L1
IOPIN -320 384 Out
FLAG 448 352 L2
IOPIN 448 352 Out
FLAG 48 128 Control
IOPIN 48 128 In
FLAG -128 864 Vdd
IOPIN -128 864 In
FLAG 272 864 Vss
IOPIN 272 864 In
FLAG 48 1104 Control
IOPIN 48 1104 In
FLAG 368 544 Vss
IOPIN 368 544 In
FLAG 336 160 Vdd
IOPIN 336 160 In
SYMBOL transgate 32 368 R0
SYMATTR InstName X1
SYMBOL inversor 48 864 R270
SYMATTR InstName X2

The netlist it stands for:
* TOTAL.asc
XX1 N001 Vdd 0 V- Vref1 Vref2 opamp
C1 V- N001 3.43p
I1 Vdd N001 PULSE(0 20n 100u 0 0 1 1)
V1 Vdd 0 1.8
V2 Vref1 0 1.3
XX2 V- Vref2 0 Vref2 Vdd comparador Vref1 comparator
V3 Vref2 0 0.6
XX3 Vdd Vdd 0 control comparador NC_01 N002 ffd
XX4 N003 Vdd 0 Vout control N003 0 ffd
XX5 control Vdd 0 N002 delay
XX6 N001 control 0 V- Vdd llave

* block symbol definitions
.subckt opamp V- Vdd Vss Vout V+ Vbias
M1 N004 V- N006 Vss CMOSN l={L1} w={W1} ad={Ldiffn*W1} as={Ldiffn*W1} pd={2*Ldiffn+W1} ps={2*Ldiffn+W1}
M2 N005 V+ N006 Vss CMOSN l={L2} w={W2} ad={Ldiffn*W2} as={Ldiffn*W2} pd={2*Ldiffn+W2} ps={2*Ldiffn+W2}
M3 Vdd N004 N004 N001 CMOSP l={L3} w={W3} ad={Ldiffp*W3} as={Ldiffp*W3} pd={2*Ldiffp+W3} ps={2*Ldiffp+W3}
M4 Vdd N004 N005 N002 CMOSP l={L4} w={W4} ad={Ldiffp*W4} as={Ldiffp*W4} pd={2*Ldiffp+W4} ps={2*Ldiffp+W4}
M5 N006 Vbias Vss N007 CMOSN l={L5} w={W5} ad={Ldiffn*W5} as={Ldiffn*W5} pd={2*Ldiffn+W5} ps={2*Ldiffn+W5}
M6 Vdd N005 Vout N003 CMOSP l={L6} w={W6} ad={Ldiffp*W6} as={Ldiffp*W6} pd={2*Ldiffp+W6} ps={2*Ldiffp+W6}
M7 Vout Vbias Vss N008 CMOSN l={L7} w={W7} ad={Ldiffn*W7} as={Ldiffn*W7} pd={2*Ldiffn+W7} ps={2*Ldiffn+W7}
C1 Vout N005 {Cc}
.include ./T180nm.lib
.param Ldiffn=0.48u Ldiffp=0.48u
.param W1={S1*L1} L1={L}
.param W2={S2*L2} L2={L}
.param W3={S3*L3} L3={L}
.param W4={S4*L4} L4={L}
.param W5={S5*L5} L5={L}
.param Cc=15p
.param L=10u
.param W6={S6*L6} L6={L}
.param W7={S7*L7} L7={L}
.param S1=8
.param S2=8
.param S3=1
.param S4=1
.param S5=1
.param S6=59
.param S7=29
.ends opamp

.subckt comparator - + Vss Vbiasn Vdd Vout Vbiasp
XX1 + - Vdd Vss N001 N004 Vbiasn preamp
XX2 N002 N003 Vss N004 N001 decision
XX3 Vbiasp Vout Vss N003 N002 Vdd output_buffer
.ends comparator

.subckt preamp Vp Vm Vdd Vss Iop Iom Vbias
M1 N003 Vp N007 Vss CMOSN l={L1} w={W1} ad={Ldiffn*W1} as={Ldiffn*W1} pd={2*Ldiffn+W1} ps={2*Ldiffn+W1}
M41 Vdd N006 N006 N004 CMOSP l={L41} w={W41} ad={Ldiffp*W41} as={Ldiffp*W41} pd={2*Ldiffp+W41} ps={2*Ldiffp+W41}
M2 N006 Vm N007 Vss CMOSN l={L2} w={W2} ad={Ldiffn*W2} as={Ldiffn*W2} pd={2*Ldiffn+W2} ps={2*Ldiffn+W2}
M31 Vdd N003 N003 N001 CMOSP l={L31} w={W31} ad={Ldiffp*W31} as={Ldiffp*W31} pd={2*Ldiffp+W31} ps={2*Ldiffp+W31}
M3 Vdd N003 Iop N002 CMOSP l={L3} w={W3} ad={Ldiffp*W3} as={Ldiffp*W3} pd={2*Ldiffp+W3} ps={2*Ldiffp+W3}
M4 Vdd N006 Iom N005 CMOSP l={L4} w={W4} ad={Ldiffp*W4} as={Ldiffp*W4} pd={2*Ldiffp+W4} ps={2*Ldiffp+W4}
MB N007 Vbias Vss N008 CMOSN l={LB} w={WB} ad={Ldiffn*WB} as={Ldiffn*WB} pd={2*Ldiffn+WB} ps={2*Ldiffn+WB}
.include ./T180nm.lib
.param Ldiffn=0.48u Ldiffp=0.48u
.param W1=50u L1=10u
.param W2=50u L2=10u
.param W31=150u L31=10u
.param W41=150u L41=10u
.param W3=150u L3=10u
.param W4=150u L4=10u
.param WB=100u LB=10u
.ends preamp

.subckt decision Vop Vom Vss Iom Iop
M6 Vop Vom N005 N002 CMOSN l={L6} w={W6} ad={Ldiffn*W6} as={Ldiffn*W6} pd={2*Ldiffn+W6} ps={2*Ldiffn+W6}
M8 Vom Vom N005 N004 CMOSN l={L8} w={W8} ad={Ldiffn*W8} as={Ldiffn*W8} pd={2*Ldiffn+W8} ps={2*Ldiffn+W8}
M7 Vom Vop N005 N003 CMOSN l={L7} w={W7} ad={Ldiffn*W7} as={Ldiffn*W7} pd={2*Ldiffn+W7} ps={2*Ldiffn+W7}
M5 Vop Vop N005 N001 CMOSN l={L5} w={W5} ad={Ldiffn*W5} as={Ldiffn*W5} pd={2*Ldiffn+W5} ps={2*Ldiffn+W5}
R1 Iop Vop 1m
R2 Iom Vom 1m
MS N005 N005 Vss N006 CMOSN l={LS} w={WS} ad={Ldiffn*WS} as={Ldiffn*WS} pd={2*Ldiffn+WS} ps={2*Ldiffn+WS}
.include ./T180nm.lib
.param Ldiffn=0.48u Ldiffp=0.48u
.param W5=100u L5=10u
.param W6=100u L6=10u
.param W7=100u L7=10u
.param W8=100u L8=10u
.param WS=10u LS=10u
.ends decision

.subckt output_buffer Vbias Vout Vss V- V+ Vdd
M11 N005 N005 Vss N007 CMOSN l={L11} w={W11} ad={Ldiffn*W11} as={Ldiffn*W11} pd={2*Ldiffn+W11} ps={2*Ldiffn+W11}
M12 N006 N005 Vss N008 CMOSN l={L12} w={W12} ad={Ldiffn*W12} as={Ldiffn*W12} pd={2*Ldiffn+W12} ps={2*Ldiffn+W12}
M9 N002 V- N005 N003 CMOSP l={L9} w={W9} ad={Ldiffp*W9} as={Ldiffp*W9} pd={2*Ldiffp+W9} ps={2*Ldiffp+W9}
MB Vdd Vbias N002 N001 CMOSP l={LB} w={WB} ad={Ldiffp*WB} as={Ldiffp*WB} pd={2*Ldiffp+WB} ps={2*Ldiffp+WB}
M10 N002 V+ N006 N004 CMOSP l={L10} w={W10} ad={Ldiffp*W10} as={Ldiffp*W10} pd={2*Ldiffp+W10} ps={2*Ldiffp+W10}
XX1 N006 Vdd Vss Vout inversor
.include ./T180nm.lib
.param Ldiffn=0.48u Ldiffp=0.48u
.param W9=200u L9=10u
.param W10=200u L10=10u
.param W11=100u L11=10u
.param W12=100u L12=10u
.param WB=500u LB=10u
.ends output_buffer

.subckt inversor Vin Vdd Vss Vout
M1 Vout Vin Vss Vss CMOSN l={Ln} w={Wn} ad={Ldiffn*Wn} as={Ldiffn*Wn} pd={2*Ldiffn+Wn} ps={2*Ldiffn+Wn}
M2 Vdd Vin Vout Vdd CMOSP l={Lp} w={Wp} ad={Ldiffp*Wp} as={Ldiffp*Wp} pd={2*Ldiffp+Wp} ps={2*Ldiffp+Wp}
.include ./T180nm.lib
.param Lp=180n Wp=001u Ldiffp=0.48u
.param Ln=180n Wn=500n Ldiffn=0.48u
.ends inversor

.subckt ffd D Vdd Vss Q Clk ~Q R
XX1 D Vdd Vss N001 Clk NC_01 N002 latch_negativo
XX2 N001 Vdd Vss Q Clk ~Q N002 latch_positivo
XX3 R Vdd Vss N002 inversor
.ends ffd

.subckt latch_negativo L Vdd Vss Q Clk ~Q R
XX1 Q Vdd Vss N001 L Clk N002 mux
XX2 N001 Vdd Vss ~Q R nand
XX3 ~Q Vdd Vss Q inversor
XX4 Clk Vdd Vss N002 inversor
.ends latch_negativo

.subckt mux V1 Vdd Vss Vout V0 Control ~Control
XX1 N002 Vdd Vss N001 Control ~Control transgate
XX2 N003 Vdd Vss N001 ~Control Control transgate
XX3 V1 Vdd Vss N002 inversor
XX4 V0 Vdd Vss N003 inversor
XX5 N001 Vdd Vss Vout inversor
.ends mux

.subckt transgate Vin Vdd Vss Vout Control ~Control
M1 Vout Control Vin Vss CMOSN l={Ln} w={Wn} ad={Ldiffn*Wn} as={Ldiffn*Wn} pd={2*Ldiffn+Wn} ps={2*Ldiffn+Wn}
M2 Vin ~Control Vout Vdd CMOSP l={Lp} w={Wp} ad={Ldiffp*Wp} as={Ldiffp*Wp} pd={2*Ldiffp+Wp} ps={2*Ldiffp+Wp}
.include ./T180nm.lib
.param Lp=180n Wp=001u Ldiffp=0.48u
.param Ln=180n Wn=500n Ldiffn=0.48u
.ends transgate

.subckt nand A Vdd Vss Vout B
M1 Vout A N002 N001 CMOSN l={Ln} w={Wn} ad={Ldiffn*Wn} as={Ldiffn*Wn} pd={2*Ldiffn+Wn} ps={2*Ldiffn+Wn}
M2 Vdd A Vout Vdd CMOSP l={Lp} w={Wp} ad={Ldiffp*Wp} as={Ldiffp*Wp} pd={2*Ldiffp+Wp} ps={2*Ldiffp+Wp}
M3 Vdd B Vout Vdd CMOSP l={Lp} w={Wp} ad={Ldiffp*Wp} as={Ldiffp*Wp} pd={2*Ldiffp+Wp} ps={2*Ldiffp+Wp}
M4 N002 B Vss N001 CMOSN l={Ln} w={Wn} ad={Ldiffn*Wn} as={Ldiffn*Wn} pd={2*Ldiffn+Wn} ps={2*Ldiffn+Wn}
.include ./T180nm.lib
.param Lp=180n Wp=001u Ldiffp=0.48u
.param Ln=180n Wn=500n Ldiffn=0.48u
.ends nand

.subckt latch_positivo L Vdd Vss Q Clk ~Q R
XX1 L Vdd Vss N001 Q Clk N002 mux
XX2 N001 Vdd Vss ~Q R nand
XX3 ~Q Vdd Vss Q inversor
XX4 Clk Vdd Vss N002 inversor
.ends latch_positivo

.subckt delay Vin Vdd Vss Vout
XX1 Vin Vdd Vss N001 inversor
XX2 N001 Vdd Vss N002 inversor params: Lp={L} Ln={L} Wp={W} Wn={W/2}
XX3 N002 Vdd Vss N003 inversor params: Lp={L} Ln={L} Wp={W} Wn={W/2}
C1 N002 Vss {C}
XX4 N003 Vdd Vss Vout inversor
.param L=3u W=1u C=1.55p
.ends delay

.subckt llave L1 Control Vss L2 Vdd
XX1 L1 Vdd Vss L2 Control N001 transgate
XX2 Control Vdd Vss N001 inversor
.ends llave

.model NMOS NMOS
.model PMOS PMOS
.lib standard.mos
.tran 0 900u 195u 0.01u
.backanno
.end